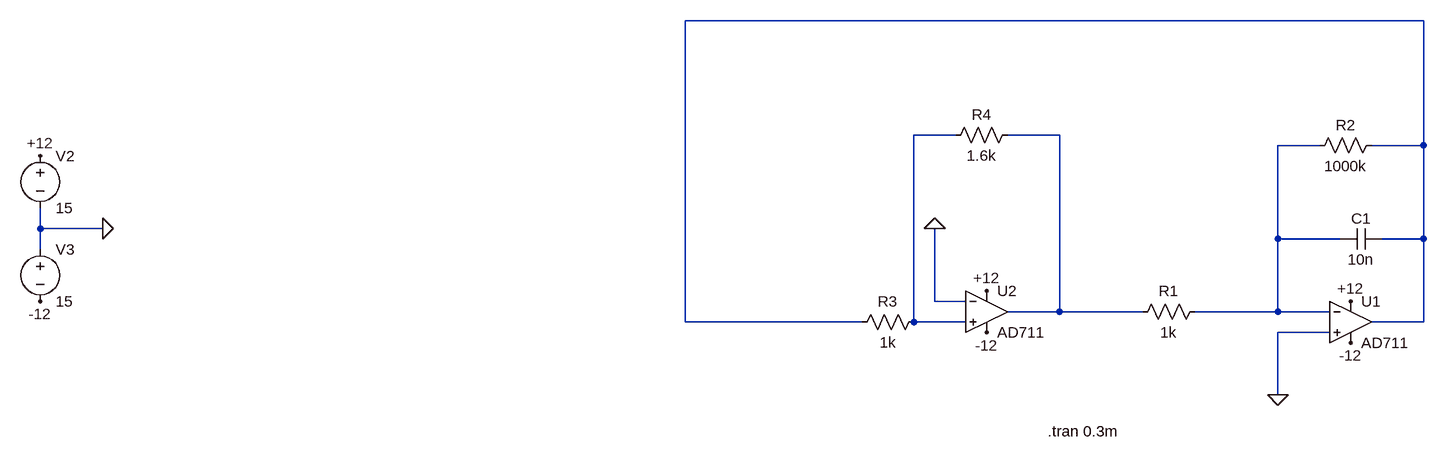
[diagram p0: schematic Montage 1 et 2.asc]
Montage 1 et 2.asc, the LTspice schematic file:
Version 4
SHEET 1 880 680
WIRE 464 -224 -672 -224
WIRE -256 -48 -320 -48
WIRE -96 -48 -176 -48
WIRE 304 -32 240 -32
WIRE 464 -32 464 -224
WIRE 464 -32 384 -32
WIRE -1664 96 -1664 64
WIRE -1568 96 -1664 96
WIRE 240 112 240 -32
WIRE 336 112 240 112
WIRE 464 112 464 -32
WIRE 464 112 400 112
WIRE -1664 128 -1664 96
WIRE -288 208 -288 96
WIRE -240 208 -288 208
WIRE -96 224 -96 -48
WIRE -96 224 -176 224
WIRE 32 224 -96 224
WIRE 240 224 240 112
WIRE 240 224 112 224
WIRE 320 224 240 224
WIRE -672 240 -672 -224
WIRE -400 240 -672 240
WIRE -320 240 -320 -48
WIRE -240 240 -320 240
WIRE 464 240 464 112
WIRE 464 240 384 240
WIRE 320 256 240 256
WIRE 240 352 240 256
FLAG 240 352 0
FLAG 352 208 +12
FLAG 352 272 -12
FLAG -1664 -16 +12
FLAG -1664 208 -12
FLAG -1568 96 0
FLAG -208 192 +12
FLAG -208 256 -12
FLAG -288 96 0
SYMBOL res 128 208 R90
WINDOW 0 0 56 VBottom 2
WINDOW 3 32 56 VTop 2
SYMATTR InstName R1
SYMATTR Value 1k
SYMBOL OpAmps\\AD711 352 176 R0
SYMATTR InstName U1
SYMBOL res 400 -48 R90
WINDOW 0 0 56 VBottom 2
WINDOW 3 32 56 VTop 2
SYMATTR InstName R2
SYMATTR Value 1000k
SYMBOL cap 400 96 R90
WINDOW 0 0 32 VBottom 2
WINDOW 3 32 32 VTop 2
SYMATTR InstName C1
SYMATTR Value 10n
SYMBOL voltage -1664 112 R0
WINDOW 123 0 0 Left 0
WINDOW 39 0 0 Left 0
SYMATTR InstName V3
SYMATTR Value 15
SYMBOL voltage -1664 -32 R0
WINDOW 123 0 0 Left 0
WINDOW 39 0 0 Left 0
SYMATTR InstName V2
SYMATTR Value 15
SYMBOL OpAmps\\AD711 -208 160 R0
SYMATTR InstName U2
SYMBOL res -160 -64 R90
WINDOW 0 0 56 VBottom 2
WINDOW 3 32 56 VTop 2
SYMATTR InstName R4
SYMATTR Value 1.6k
SYMBOL res -304 224 R90
WINDOW 0 0 56 VBottom 2
WINDOW 3 32 56 VTop 2
SYMATTR InstName R3
SYMATTR Value 1k
TEXT -114 408 Left 2 !.tran 0.3m

The netlist it stands for:
* Montage 1 et 2.asc
R1 N004 N003 1k
XU1 0 N004 +12 -12 N001 AD712  ; AD711, pins In+ In- V+ V- OUT
R2 N001 N004 1000k
C1 N001 N004 10n
V3 0 -12 15
V2 +12 0 15
XU2 N002 0 +12 -12 N003 AD712  ; AD711, pins In+ In- V+ V- OUT
R4 N003 N002 1.6k
R3 N002 N001 1k
.tran 0.3m
.lib ADI1.lib
.backanno
.end